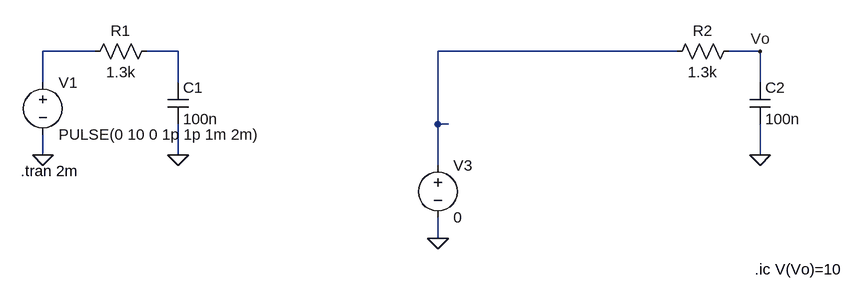
[diagram p0: schematic faltungsintegral.asc]
faltungsintegral.asc, the LTspice schematic file:
Version 4
SHEET 1 1372 680
WIRE 192 176 112 176
WIRE 320 176 272 176
WIRE 1088 176 720 176
WIRE 1216 176 1168 176
WIRE 112 224 112 176
WIRE 320 224 320 176
WIRE 1216 224 1216 176
WIRE 720 288 720 176
WIRE 736 288 720 288
WIRE 112 336 112 304
WIRE 320 336 320 288
WIRE 1216 336 1216 288
WIRE 720 352 720 288
WIRE 720 464 720 432
FLAG 112 336 0
FLAG 320 336 0
FLAG 1216 336 0
FLAG 720 464 0
FLAG 1216 176 Vo
SYMBOL res 288 160 R90
WINDOW 0 0 56 VBottom 2
WINDOW 3 32 56 VTop 2
SYMATTR InstName R1
SYMATTR Value 1.3k
SYMBOL cap 304 224 R0
SYMATTR InstName C1
SYMATTR Value 100n
SYMBOL voltage 112 208 R0
WINDOW 123 0 0 Left 2
WINDOW 39 0 0 Left 2
SYMATTR InstName V1
SYMATTR Value PULSE(0 10 0 1p 1p 1m 2m)
SYMBOL res 1184 160 R90
WINDOW 0 0 56 VBottom 2
WINDOW 3 32 56 VTop 2
SYMATTR InstName R2
SYMATTR Value 1.3k
SYMBOL cap 1200 224 R0
SYMATTR InstName C2
SYMATTR Value 100n
SYMBOL voltage 720 336 R0
WINDOW 123 0 0 Left 2
WINDOW 39 0 0 Left 2
SYMATTR InstName V3
SYMATTR Value 0
TEXT 78 360 Left 2 !.tran 2m
TEXT 1208 512 Left 2 !.ic V(Vo)=10

The netlist it stands for:
* faltungsintegral.asc
R1 N002 N001 1.3k
C1 N002 0 100n
V1 N001 0 PULSE(0 10 0 1p 1p 1m 2m)
R2 Vo N003 1.3k
C2 Vo 0 100n
V3 N003 0 0
.tran 2m
.ic V(Vo)=10
.backanno
.end